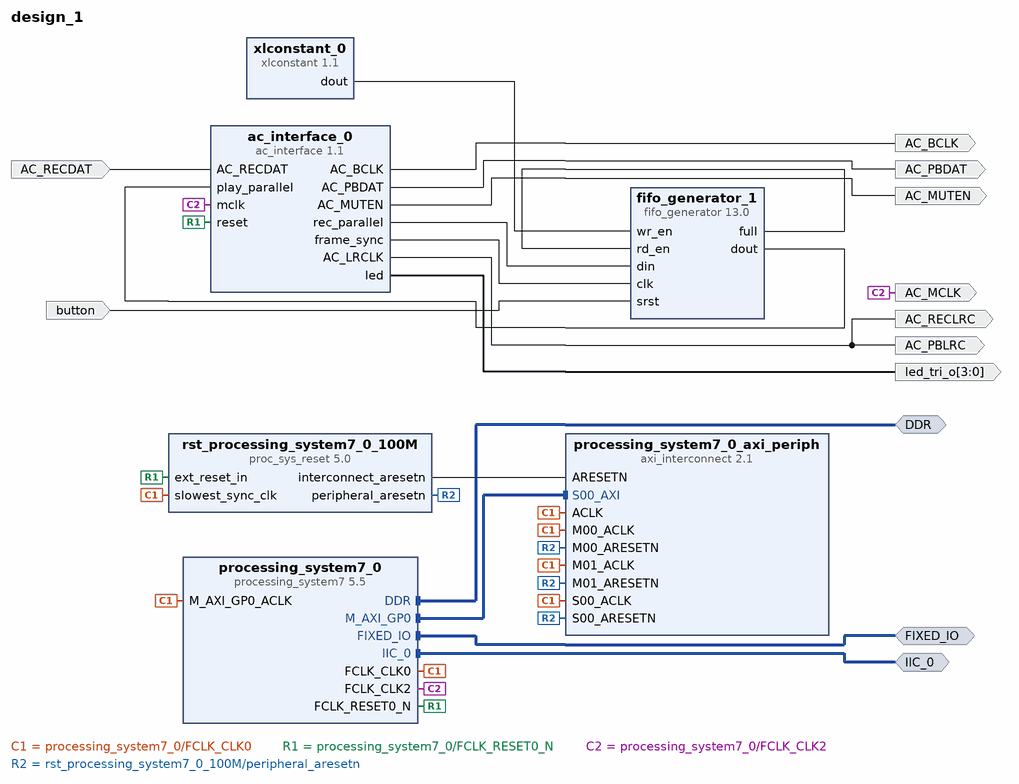
[diagram p0: block diagram of the top level]
# Vivado block design design_1, Vivado 2015.4
create_bd_design design_1

create_bd_intf_port -mode Master -vlnv xilinx.com:interface:ddrx_rtl:1.0 DDR
create_bd_intf_port -mode Master -vlnv xilinx.com:display_processing_system7:fixedio_rtl:1.0 FIXED_IO
create_bd_intf_port -mode Master -vlnv xilinx.com:interface:iic_rtl:1.0 IIC_0
create_bd_port -dir O AC_BCLK
create_bd_port -dir O AC_PBDAT
create_bd_port -dir O AC_PBLRC
create_bd_port -dir O AC_RECLRC
create_bd_port -dir I AC_RECDAT
create_bd_port -dir O AC_MCLK
create_bd_port -dir O AC_MUTEN
create_bd_port -dir O -from 3 -to 0 led_tri_o
create_bd_port -dir I button

create_bd_cell -type ip -vlnv xilinx.com:ip:xlconstant:1.1 xlconstant_0
create_bd_cell -type ip -vlnv xilinx.com:ip:processing_system7:5.5 processing_system7_0
set_property -dict [list \
  CONFIG.PCW_EN_CLK2_PORT 1 \
  CONFIG.PCW_IMPORT_BOARD_PRESET /home/nolan/Downloads/ZYBO_zynq_def.xml \
  CONFIG.PCW_QSPI_GRP_SINGLE_SS_ENABLE 1 \
  CONFIG.PCW_ENET0_PERIPHERAL_ENABLE 0 \
  CONFIG.PCW_SD0_PERIPHERAL_ENABLE 0 \
  CONFIG.PCW_UART1_PERIPHERAL_ENABLE 1 \
  CONFIG.PCW_WDT_PERIPHERAL_ENABLE 1 \
  CONFIG.PCW_TTC0_PERIPHERAL_ENABLE 1 \
  CONFIG.PCW_USB0_PERIPHERAL_ENABLE 0 \
  CONFIG.PCW_I2C0_PERIPHERAL_ENABLE 1 \
  CONFIG.PCW_I2C0_I2C0_IO EMIO \
  CONFIG.PCW_GPIO_MIO_GPIO_ENABLE 1 \
] [get_bd_cells processing_system7_0]
# 3 more settings of processing_system7_0 are not shown: defaults, MIO pin electricals, DDR timing, and values the tool derives
create_bd_cell -type ip -vlnv xilinx.com:ip:axi_interconnect:2.1 processing_system7_0_axi_periph
set_property -dict {CONFIG.NUM_MI 2} [get_bd_cells processing_system7_0_axi_periph]
create_bd_cell -type ip -vlnv xilinx.com:ip:proc_sys_reset:5.0 rst_processing_system7_0_100M
create_bd_cell -type ip -vlnv xilinx.com:ip:fifo_generator:13.0 fifo_generator_1
set_property -dict [list \
  CONFIG.Input_Data_Width 32 \
  CONFIG.Input_Depth 8192 \
  CONFIG.Output_Data_Width 32 \
] [get_bd_cells fifo_generator_1]
create_bd_cell -type ip -vlnv Nolan:user:ac_interface:1.1 ac_interface_0

# ---- connections ----

connect_bd_intf_net [get_bd_intf_pins processing_system7_0/M_AXI_GP0] [get_bd_intf_pins processing_system7_0_axi_periph/S00_AXI]
connect_bd_intf_net [get_bd_intf_ports DDR] [get_bd_intf_pins processing_system7_0/DDR]
connect_bd_intf_net [get_bd_intf_ports FIXED_IO] [get_bd_intf_pins processing_system7_0/FIXED_IO]
connect_bd_intf_net [get_bd_intf_ports IIC_0] [get_bd_intf_pins processing_system7_0/IIC_0]
connect_bd_net [get_bd_pins processing_system7_0/FCLK_CLK0] \
  [get_bd_pins processing_system7_0/M_AXI_GP0_ACLK] [get_bd_pins processing_system7_0_axi_periph/ACLK] \
  [get_bd_pins processing_system7_0_axi_periph/S00_ACLK] [get_bd_pins processing_system7_0_axi_periph/M00_ACLK] \
  [get_bd_pins processing_system7_0_axi_periph/M01_ACLK] [get_bd_pins rst_processing_system7_0_100M/slowest_sync_clk]
connect_bd_net [get_bd_pins processing_system7_0/FCLK_RESET0_N] \
  [get_bd_pins rst_processing_system7_0_100M/ext_reset_in] [get_bd_pins ac_interface_0/reset]
connect_bd_net [get_bd_pins rst_processing_system7_0_100M/interconnect_aresetn] [get_bd_pins processing_system7_0_axi_periph/ARESETN]
connect_bd_net [get_bd_pins ac_interface_0/AC_BCLK] [get_bd_ports AC_BCLK]
connect_bd_net [get_bd_pins ac_interface_0/AC_PBDAT] [get_bd_ports AC_PBDAT]
connect_bd_net -net ac_interface_0_AC_RECLRC [get_bd_pins ac_interface_0/AC_LRCLK] [get_bd_ports AC_RECLRC] [get_bd_ports AC_PBLRC]
connect_bd_net [get_bd_ports AC_RECDAT] [get_bd_pins ac_interface_0/AC_RECDAT]
connect_bd_net [get_bd_pins processing_system7_0/FCLK_CLK2] [get_bd_ports AC_MCLK] [get_bd_pins ac_interface_0/mclk]
connect_bd_net [get_bd_pins ac_interface_0/AC_MUTEN] [get_bd_ports AC_MUTEN]
connect_bd_net [get_bd_pins ac_interface_0/led] [get_bd_ports led_tri_o]
connect_bd_net [get_bd_pins rst_processing_system7_0_100M/peripheral_aresetn] \
  [get_bd_pins processing_system7_0_axi_periph/S00_ARESETN] [get_bd_pins processing_system7_0_axi_periph/M00_ARESETN] \
  [get_bd_pins processing_system7_0_axi_periph/M01_ARESETN]
connect_bd_net [get_bd_pins xlconstant_0/dout] [get_bd_pins fifo_generator_1/wr_en]
connect_bd_net [get_bd_pins fifo_generator_1/dout] [get_bd_pins ac_interface_0/play_parallel]
connect_bd_net [get_bd_pins ac_interface_0/rec_parallel] [get_bd_pins fifo_generator_1/din]
connect_bd_net [get_bd_pins fifo_generator_1/full] [get_bd_pins fifo_generator_1/rd_en]
connect_bd_net [get_bd_pins ac_interface_0/frame_sync] [get_bd_pins fifo_generator_1/clk]
connect_bd_net [get_bd_ports button] [get_bd_pins fifo_generator_1/srst]

validate_bd_design
save_bd_design
